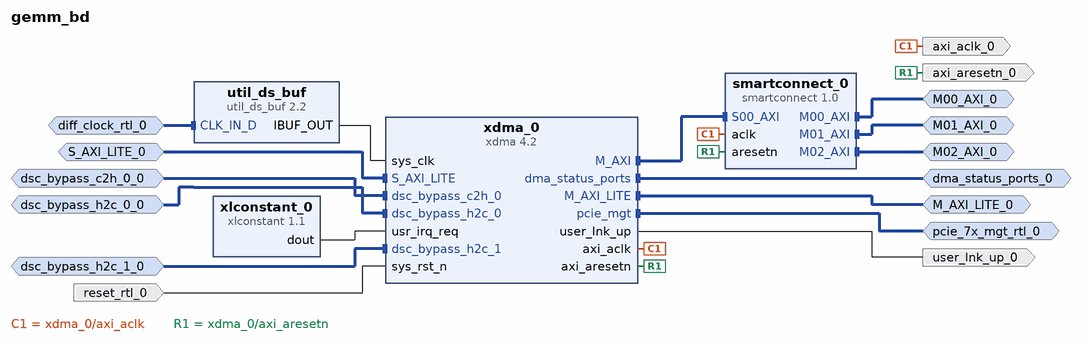
[diagram p0: block diagram of the top level]
# Vivado block design gemm_bd, xc7a100tfgg484-2, Vivado 2026.1
create_bd_design gemm_bd

create_bd_intf_port -mode Master -vlnv xilinx.com:interface:pcie_7x_mgt_rtl:1.0 pcie_7x_mgt_rtl_0
create_bd_intf_port -mode Slave -vlnv xilinx.com:interface:diff_clock_rtl:1.0 diff_clock_rtl_0
set_property -dict {CONFIG.FREQ_HZ 100000000} [get_bd_intf_ports diff_clock_rtl_0]
create_bd_intf_port -mode Slave -vlnv xilinx.com:interface:aximm_rtl:1.0 S_AXI_LITE_0
set_property -dict [list \
  CONFIG.ADDR_WIDTH 32 \
  CONFIG.ARUSER_WIDTH 0 \
  CONFIG.AWUSER_WIDTH 0 \
  CONFIG.BUSER_WIDTH 0 \
  CONFIG.DATA_WIDTH 32 \
  CONFIG.HAS_BRESP 1 \
  CONFIG.HAS_BURST 0 \
  CONFIG.HAS_CACHE 0 \
  CONFIG.HAS_LOCK 0 \
  CONFIG.HAS_PROT 1 \
  CONFIG.HAS_QOS 0 \
  CONFIG.HAS_REGION 0 \
  CONFIG.HAS_RRESP 1 \
  CONFIG.HAS_WSTRB 1 \
  CONFIG.ID_WIDTH 0 \
  CONFIG.NUM_READ_OUTSTANDING 1 \
  CONFIG.NUM_READ_THREADS 1 \
  CONFIG.NUM_WRITE_OUTSTANDING 1 \
  CONFIG.NUM_WRITE_THREADS 1 \
  CONFIG.PROTOCOL AXI4LITE \
  CONFIG.READ_WRITE_MODE READ_WRITE \
  CONFIG.RUSER_BITS_PER_BYTE 0 \
  CONFIG.RUSER_WIDTH 0 \
  CONFIG.WUSER_BITS_PER_BYTE 0 \
  CONFIG.WUSER_WIDTH 0 \
] [get_bd_intf_ports S_AXI_LITE_0]
create_bd_intf_port -mode Master -vlnv xilinx.com:interface:aximm_rtl:1.0 M_AXI_LITE_0
set_property -dict [list \
  CONFIG.ADDR_WIDTH 32 \
  CONFIG.DATA_WIDTH 32 \
  CONFIG.HAS_BURST 0 \
  CONFIG.HAS_CACHE 0 \
  CONFIG.HAS_LOCK 0 \
  CONFIG.HAS_QOS 0 \
  CONFIG.HAS_REGION 0 \
  CONFIG.PROTOCOL AXI4LITE \
] [get_bd_intf_ports M_AXI_LITE_0]
create_bd_intf_port -mode Slave -vlnv xilinx.com:display_xdma:dsc_bypass_rtl:1.0 dsc_bypass_c2h_0_0
create_bd_intf_port -mode Slave -vlnv xilinx.com:display_xdma:dsc_bypass_rtl:1.0 dsc_bypass_h2c_0_0
create_bd_intf_port -mode Slave -vlnv xilinx.com:display_xdma:dsc_bypass_rtl:1.0 dsc_bypass_h2c_1_0
create_bd_intf_port -mode Master -vlnv xilinx.com:display_xdma:xdma_status_ports_rtl:1.0 dma_status_ports_0
create_bd_intf_port -mode Master -vlnv xilinx.com:interface:aximm_rtl:1.0 M00_AXI_0
set_property -dict [list \
  CONFIG.ADDR_WIDTH 64 \
  CONFIG.DATA_WIDTH 128 \
  CONFIG.FREQ_HZ 125000000 \
  CONFIG.PROTOCOL AXI4 \
] [get_bd_intf_ports M00_AXI_0]
create_bd_intf_port -mode Master -vlnv xilinx.com:interface:aximm_rtl:1.0 M01_AXI_0
set_property -dict [list \
  CONFIG.ADDR_WIDTH 64 \
  CONFIG.DATA_WIDTH 128 \
  CONFIG.FREQ_HZ 125000000 \
  CONFIG.PROTOCOL AXI4 \
] [get_bd_intf_ports M01_AXI_0]
create_bd_intf_port -mode Master -vlnv xilinx.com:interface:aximm_rtl:1.0 M02_AXI_0
set_property -dict [list \
  CONFIG.ADDR_WIDTH 64 \
  CONFIG.DATA_WIDTH 128 \
  CONFIG.FREQ_HZ 125000000 \
  CONFIG.PROTOCOL AXI4 \
] [get_bd_intf_ports M02_AXI_0]
create_bd_port -dir I -type rst reset_rtl_0
set_property -dict {CONFIG.POLARITY ACTIVE_LOW} [get_bd_ports reset_rtl_0]
create_bd_port -dir O -type rst axi_aresetn_0
create_bd_port -dir O -type clk axi_aclk_0
create_bd_port -dir O user_lnk_up_0

create_bd_cell -type ip -vlnv xilinx.com:ip:xdma:4.2 xdma_0
set_property -dict [list \
  CONFIG.axi_data_width 128_bit \
  CONFIG.axil_master_64bit_en true \
  CONFIG.axilite_master_en true \
  CONFIG.axisten_freq 125 \
  CONFIG.dsc_bypass_rd 0011 \
  CONFIG.dsc_bypass_wr 0001 \
  CONFIG.pl_link_cap_max_link_speed 5.0_GT/s \
  CONFIG.pl_link_cap_max_link_width X4 \
  CONFIG.xdma_axi_intf_mm AXI_Memory_Mapped \
  CONFIG.xdma_axilite_slave true \
  CONFIG.xdma_pcie_64bit_en true \
  CONFIG.xdma_rnum_chnl 2 \
  CONFIG.xdma_sts_ports true \
  CONFIG.xdma_wnum_chnl 1 \
] [get_bd_cells xdma_0]
create_bd_cell -type ip -vlnv xilinx.com:ip:util_ds_buf:2.2 util_ds_buf
set_property -dict {CONFIG.C_BUF_TYPE IBUFDSGTE} [get_bd_cells util_ds_buf]
create_bd_cell -type ip -vlnv xilinx.com:ip:xlconstant:1.1 xlconstant_0
create_bd_cell -type ip -vlnv xilinx.com:ip:smartconnect:1.0 smartconnect_0
set_property -dict {CONFIG.ADVANCED_PROPERTIES { __view__ { }} CONFIG.NUM_MI 3 CONFIG.NUM_SI 1} [get_bd_cells smartconnect_0]

# ---- connections ----

connect_bd_intf_net -intf_net S_AXI_LITE_0_1 [get_bd_intf_ports S_AXI_LITE_0] [get_bd_intf_pins xdma_0/S_AXI_LITE]
connect_bd_intf_net -intf_net diff_clock_rtl_0_1 [get_bd_intf_ports diff_clock_rtl_0] [get_bd_intf_pins util_ds_buf/CLK_IN_D]
connect_bd_intf_net -intf_net dsc_bypass_c2h_0_0_1 [get_bd_intf_ports dsc_bypass_c2h_0_0] [get_bd_intf_pins xdma_0/dsc_bypass_c2h_0]
connect_bd_intf_net -intf_net dsc_bypass_h2c_0_0_1 [get_bd_intf_ports dsc_bypass_h2c_0_0] [get_bd_intf_pins xdma_0/dsc_bypass_h2c_0]
connect_bd_intf_net -intf_net dsc_bypass_h2c_1_0_1 [get_bd_intf_ports dsc_bypass_h2c_1_0] [get_bd_intf_pins xdma_0/dsc_bypass_h2c_1]
connect_bd_intf_net [get_bd_intf_ports M00_AXI_0] [get_bd_intf_pins smartconnect_0/M00_AXI]
connect_bd_intf_net [get_bd_intf_ports M01_AXI_0] [get_bd_intf_pins smartconnect_0/M01_AXI]
connect_bd_intf_net [get_bd_intf_ports M02_AXI_0] [get_bd_intf_pins smartconnect_0/M02_AXI]
connect_bd_intf_net [get_bd_intf_pins xdma_0/M_AXI] [get_bd_intf_pins smartconnect_0/S00_AXI]
connect_bd_intf_net [get_bd_intf_ports M_AXI_LITE_0] [get_bd_intf_pins xdma_0/M_AXI_LITE]
connect_bd_intf_net [get_bd_intf_ports dma_status_ports_0] [get_bd_intf_pins xdma_0/dma_status_ports]
connect_bd_intf_net [get_bd_intf_ports pcie_7x_mgt_rtl_0] [get_bd_intf_pins xdma_0/pcie_mgt]
connect_bd_net -net reset_rtl_0_1 [get_bd_ports reset_rtl_0] [get_bd_pins xdma_0/sys_rst_n]
connect_bd_net [get_bd_pins util_ds_buf/IBUF_OUT] [get_bd_pins xdma_0/sys_clk]
connect_bd_net [get_bd_pins xdma_0/axi_aclk] [get_bd_ports axi_aclk_0] [get_bd_pins smartconnect_0/aclk]
connect_bd_net [get_bd_pins xdma_0/axi_aresetn] [get_bd_ports axi_aresetn_0] [get_bd_pins smartconnect_0/aresetn]
connect_bd_net [get_bd_pins xdma_0/user_lnk_up] [get_bd_ports user_lnk_up_0]
connect_bd_net [get_bd_pins xlconstant_0/dout] [get_bd_pins xdma_0/usr_irq_req]

# ---- address map ----
assign_bd_address -offset 0x76000000 -range 64K -target_address_space [get_bd_addr_spaces S_AXI_LITE_0] [get_bd_addr_segs xdma_0/S_AXI_LITE/CTL0]
assign_bd_address -offset 0x0000000044A00000 -range 64K -target_address_space [get_bd_addr_spaces xdma_0/M_AXI] [get_bd_addr_segs M00_AXI_0/Reg]
assign_bd_address -offset 0x0000000044A10000 -range 64K -target_address_space [get_bd_addr_spaces xdma_0/M_AXI] [get_bd_addr_segs M01_AXI_0/Reg]
assign_bd_address -offset 0x0000000044A20000 -range 64K -target_address_space [get_bd_addr_spaces xdma_0/M_AXI] [get_bd_addr_segs M02_AXI_0/Reg]
assign_bd_address -offset 0x44A00000 -range 64K -target_address_space [get_bd_addr_spaces xdma_0/M_AXI_LITE] [get_bd_addr_segs M_AXI_LITE_0/Reg]

validate_bd_design
save_bd_design
